# EAGLE schematic LED OLED  Driver Controler (EAGLE 8.3.2)

## Sheet 1 of 2
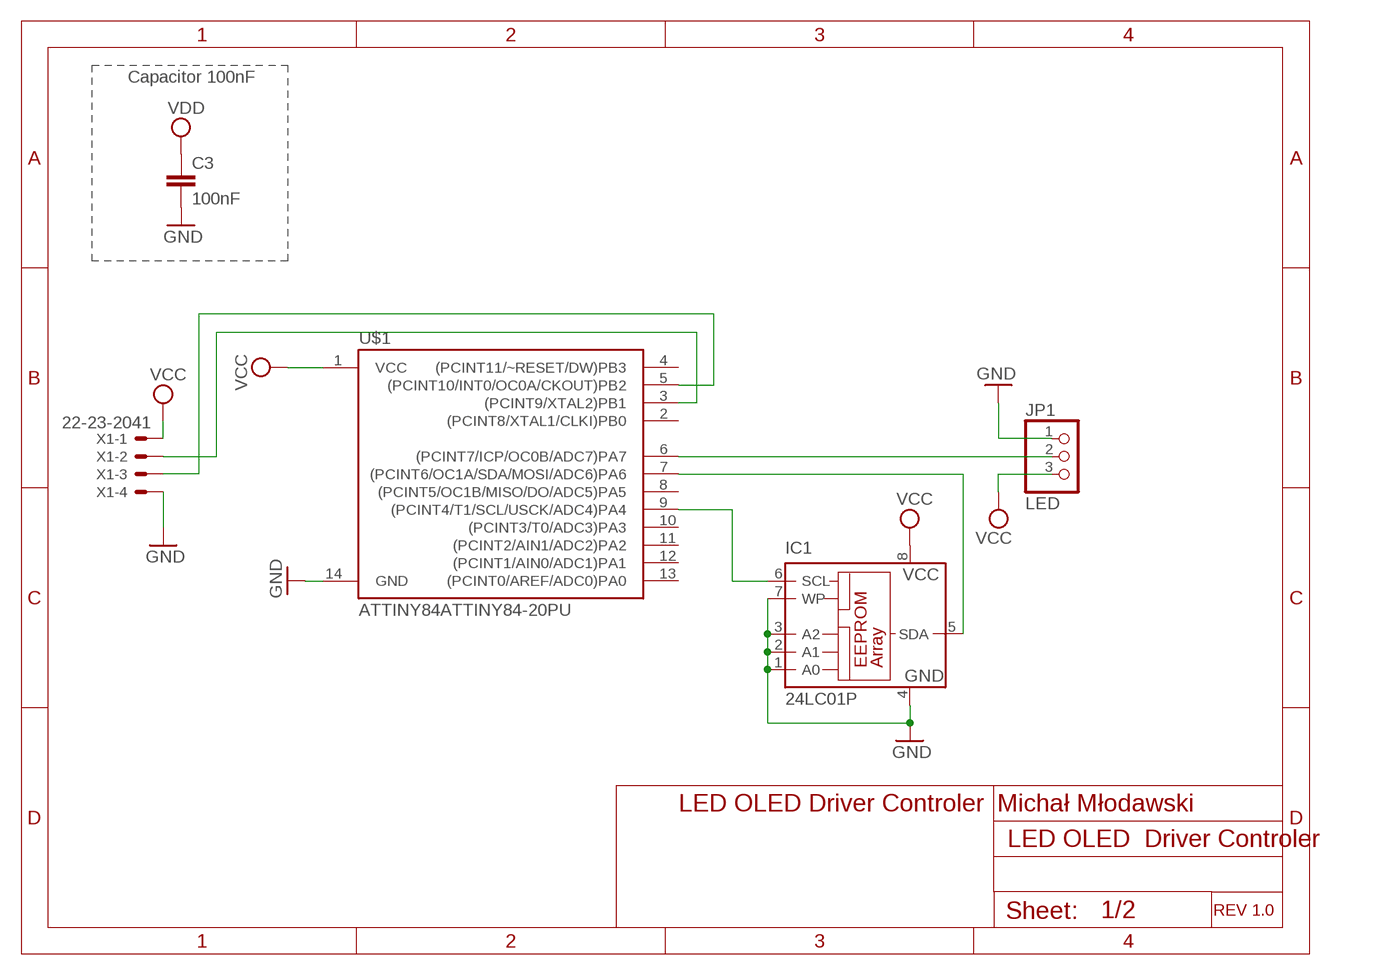
[diagram p0: schematic, sheet 1]

### Parts
C3  100nF  C2,5-3  [C2.5-3]
IC1  24LC01P  [DIL8]
JP1  LED  PINHD-1X3  [1X03]
U$1  ATTINY84ATTINY84-20PU  [DIP14]
X1  22-23-2041  [22-23-2041]

### Nets
GND: C3.2 IC1.1(A0) IC1.2(A1) IC1.3(A2) IC1.7(WP) JP1.1 U$1.14(GND) X1.4 ; also sheet 2
N$1: IC1.6(SCL) U$1.9((PCINT4/T1/SCL/USCK/ADC4)PA4)
N$2: IC1.5(SDA) U$1.7((PCINT6/OC1A/SDA/MOSI/ADC6)PA6)
N$3: JP1.2 U$1.6((PCINT7/ICP/OC0B/ADC7)PA7)
N$4: U$1.5((PCINT10/INT0/OC0A/CKOUT)PB2) X1.3
N$5: U$1.3((PCINT9/XTAL2)PB1) X1.2
VCC: IC1.8(VCC) JP1.3 U$1.1(VCC) X1.1 ; also sheet 2
VDD: C3.1 ; also sheet 2
Unconnected: U$1.2((PCINT8/XTAL1/CLKI)PB0) U$1.4((PCINT11/~RESET/DW)PB3) U$1.8((PCINT5/OC1B/MISO/DO/ADC5)PA5) U$1.10((PCINT3/T0/ADC3)PA3) U$1.11((PCINT2/AIN1/ADC2)PA2) U$1.12((PCINT1/AIN0/ADC1)PA1) U$1.13((PCINT0/AREF/ADC0)PA0)

### Notes on the sheet
- Capacitor 100nF
- Michał Młodawski
- LED OLED Driver Controler
- REV 1.0

## Sheet 2 of 2
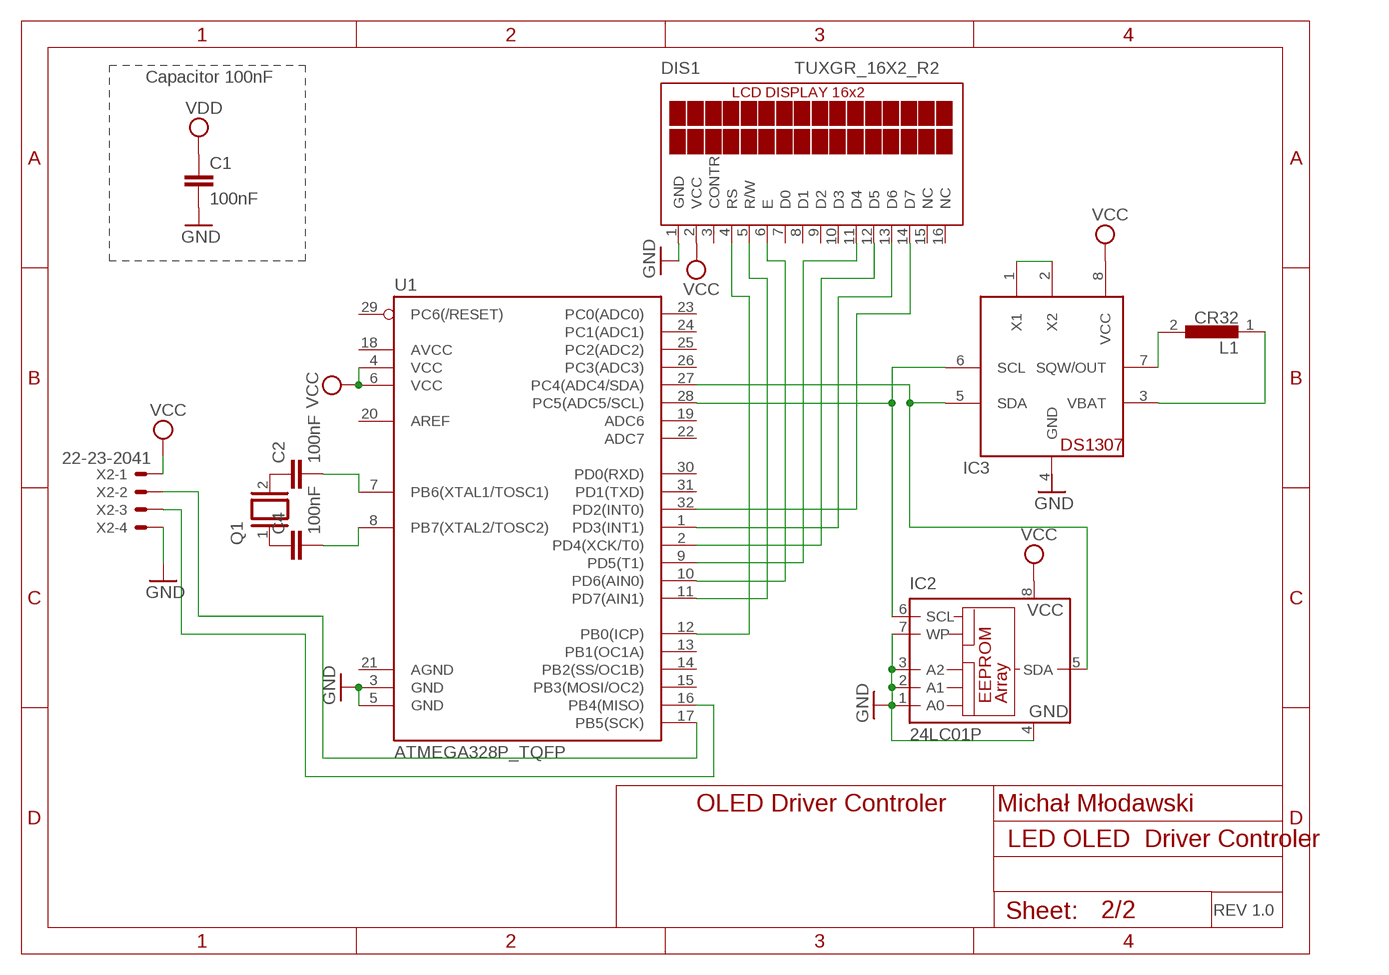
[diagram p1: schematic, sheet 2]

### Parts
C1  100nF  C2,5-3  [C2.5-3]
C2  100nF  C2,5-3  [C2.5-3]
C4  100nF  C2,5-3  [C2.5-3]
DIS1  TUXGR_16X2_R2  [TUXGR_16X2_R2]
IC2  24LC01P  [DIL8]
IC3  DS1307  [DIL08]
L1  CR32  [CR32]
Q1  XTAL  [Q]
U1  ATMEGA328P_TQFP  [TQFP32-08]
X2  22-23-2041  [22-23-2041]

### Nets
GND: C1.2 DIS1.1(GND) IC2.1(A0) IC2.2(A1) IC2.3(A2) IC2.4(GND) IC2.7(WP) U1.3(GND) U1.5(GND) X2.4 ; also sheet 1
N$6: U1.16(PB4(MISO)) X2.3
N$7: U1.17(PB5(SCK)) X2.2
N$8: DIS1.11(D4) U1.9(PD5(T1))
N$9: IC2.6(SCL) IC3.6(SCL) U1.28(PC5(ADC5/SCL))
N$10: IC2.5(SDA) IC3.5(SDA) U1.27(PC4(ADC4/SDA))
N$11: C2.1 Q1.2
N$12: IC3.1(X1) IC3.2(X2)
N$13: IC3.7(SQW/OUT) L1.2
N$14: IC3.3(VBAT) L1.1
N$15: C4.1 Q1.1
N$16: C2.2 U1.7(PB6(XTAL1/TOSC1))
N$17: C4.2 U1.8(PB7(XTAL2/TOSC2))
N$18: DIS1.4(RS) U1.12(PB0(ICP))
N$19: DIS1.5(R/W) U1.11(PD7(AIN1))
N$20: DIS1.12(D5) U1.2(PD4(XCK/T0))
N$21: DIS1.6(E) U1.10(PD6(AIN0))
N$22: DIS1.14(D7) U1.32(PD2(INT0))
N$23: DIS1.13(D6) U1.1(PD3(INT1))
VCC: DIS1.2(VCC) IC2.8(VCC) IC3.8(VCC) U1.4(VCC) U1.6(VCC) X2.1 ; also sheet 1
VDD: C1.1 ; also sheet 1
Unconnected: DIS1.3(CONTR) DIS1.7(D0) DIS1.8(D1) DIS1.9(D2) DIS1.10(D3) DIS1.15(NC) DIS1.16(NC) U1.13(PB1(OC1A)) U1.14(PB2(SS/OC1B)) U1.15(PB3(MOSI/OC2)) U1.18(AVCC) U1.19(ADC6) U1.20(AREF) U1.21(AGND) U1.22(ADC7) U1.23(PC0(ADC0)) U1.24(PC1(ADC1)) U1.25(PC2(ADC2)) U1.26(PC3(ADC3)) U1.29(PC6(/RESET)) U1.30(PD0(RXD)) U1.31(PD1(TXD))

### Notes on the sheet
- Capacitor 100nF
- Michał Młodawski
- OLED Driver Controler
- REV 1.0

## Power pins joined to a net without a drawn wire
GND: IC1.4(GND) IC3.4(GND)

## Library data of the parts
C1-C4 = capacitor-wima:C: CAPACITOR naming: grid - package width
DIS1 = display-lcd:TUXGR_16X2_R2: Tuxgraphics LCD display 16x2 characters reflective, without background light Source: tuxgr_12x2_r2.pdf; OC_FARNELL: unknown; OC_NEWARK: unknown
IC1 IC2 = microchip:24*: Serial EEPROM I2C; MPN: 24LC01BH-I/P; OC_FARNELL: 1200025; OC_NEWARK: 77M3542
IC3 = adafruit:DS1307: DS1307 Real time clock (RTC) with battery backup ability. Talk to it via i2c
JP1 = adafruit:PINHD-1X3: PIN HEADER
L1 = inductors:CR32: POWER INDUCTORS SMD CR Series Source: www.suminda.com .. CR32.pdf
Q1 = special:XTAL: CRYSTAL
U1 = SparkFun-IC-Microcontroller:ATMEGA328P_TQFP: Popular 328P in QFP Storefront component: ATmega328 - TQFP <https://www.sparkfun.com/products/13448> (COM-13448) Datasheet <http://www.sparkfun.com/datasheets/Components/SMD/ATMega328.pdf> SparkFun Products SparkFun RedBoard - Programmed with Arduino <https://www.sparkfun.com/products/12757> (DEV-12757) Arduino Pro Mini 328 - 5V/16MHz <https://www.sparkfun.com/products/11113> (DEV-11113) Arduino Pro Mini 328 - 3.3V/8MHz <https://www.sparkfun.com/products/11114> (DEV-11114) SparkFun OpenLog <https://www.sparkfun.com/products/13712> (DEV-13712) SparkFun MicroView - OLED Arduino Module <https://www.sparkfun.com/products/12923> (DEV-12923) SparkFun Digital Sandbox <https://www.sparkfun.com/products/12651> (DEV-12651) SparkFun PicoBoard <https://www.sparkfun.com/products/11888> (WIG-11888) Arduino Fio <https://www.sparkfun.com/products/10116> (DEV-10116) LilyPad Arduino 328 Main Board <https://www.sparkfun.com/products/13342> (DEV-13342) SparkFun RedStick <https://www.sparkfun.com/products/13741> (DEV-13741) LilyPad MP3 <https://www.sparkfun.com/products/11013> (DEV-11013) LilyPad Arduino SimpleSnap <https://www.sparkfun.com/products/10941> (DEV-10941) SparkFun Stepoko <https://www.sparkfun.com/products/13899> (ROB-13899) SparkFun Geiger Counter <https://www.sparkfun.com/products/11345> (SEN-11345) SparkFun EL Sequencer <https://www.sparkfun.com/products/12781> (COM-12781) Arduino Pro 328 - 5V/16MHz <https://www.sparkfun.com/products/10915> (DEV-10915) CryptoCape <https://www.sparkfun.com/products/12773> (DEV-12773) SparkFun IR Thermometer Evaluation Board - MLX90614 <https://www.sparkfun.com/products/10740> (SEN-10740) SparkFun RedBot Mainboard <https://www.sparkfun.com/products/12097> (ROB-12097) Arduino Pro 328 - 3.3V/8MHz <https://www.sparkfun.com/products/10914> (DEV-10914) SparkFun Block for Intel® Edison - Arduino <https://www.sparkfun.com/products/13036> (DEV-13036) SparkFun Simon Says - Surface Mount Soldering Kit <https://www.sparkfun.com/products/10935> (KIT-10935) SparkFun 7-Segment Serial Display - Red <https://www.sparkfun.com/products/11441> (COM-11441) SparkFun 7-Segment Serial Display - White <https://www.sparkfun.com/products/11629> (COM-11629) SparkFun 7-Segment Serial Display - Yellow <https://www.sparkfun.com/products/11443> (COM-11443) SparkFun 7-Segment Serial Display - Kelly Green <https://www.sparkfun.com/products/11440> (COM-11440) SparkFun 7-Segment Serial Display - Blue <https://www.sparkfun.com/products/11442> (COM-11442) SparkFun OpenSegment Serial Display - 20mm (Blue) <https://www.sparkfun.com/products/11647> (COM-11647) SparkFun OpenSegment Serial Display - 20mm (Green) <https://www.sparkfun.com/products/11646> (COM-11646) SparkFun OpenSegment Serial Display - 20mm (White) <https://www.sparkfun.com/products/11648> (COM-11648) SparkFun OpenSegment Serial Display - 20mm (Red) <https://www.sparkfun.com/products/11644> (COM-11644) SparkFun OpenSegment Serial Display - 20mm (Yellow) <https://www.sparkfun.com/products/11645> (COM-11645) SparkFun OpenSegment Shield <https://www.sparkfun.com/products/13190> (DEV-13190); PROD_ID: IC-09069
U$1 = SparkFun-IC-Microcontroller:ATTINY84: Atmel 14-pin 2/4/8kB flash uC Datasheet <https://cdn.sparkfun.com/datasheets/Widgets/doc8006.pdf> SparkFun Products Tiny AVR Programmer <https://www.sparkfun.com/products/11801> (PGM-11801) SparkFun Servo Trigger - Continuous Rotation <https://www.sparkfun.com/products/13872> (WIG-13872) SparkFun Servo Trigger <https://www.sparkfun.com/products/13118> (WIG-13118)
X1 X2 = con-molex:22-23-2041: .100" (2.54mm) Center Header - 4 Pin; MF: MOLEX; MPN: 22-23-2041; OC_FARNELL: 1462920; OC_NEWARK: 38C0355